# Altium schematic sheet mboard_usb.SchDoc: =GlobalProjectName
size 209 x 297 mm; SheetNumber: Лист; SheetTotal: Листов; PageSetup: Record=PageOptions|CenterHorizontal=True|CenterVertical=True|PrintScale=1.00|XCorrection=1.00|YCorrection=1.00|PrintKind=1|BorderSize=5000000|LeftOffset=0|BottomOffset=0|Orientation=2|PaperLength=1000|PaperWidth=1000|Scale=100|PaperSource=15|PrintQuality=1200|MediaType=1|DitherType=10|PaperKind=A3|PrintScaleMode=1; Weight: -; ScaleFactor: -
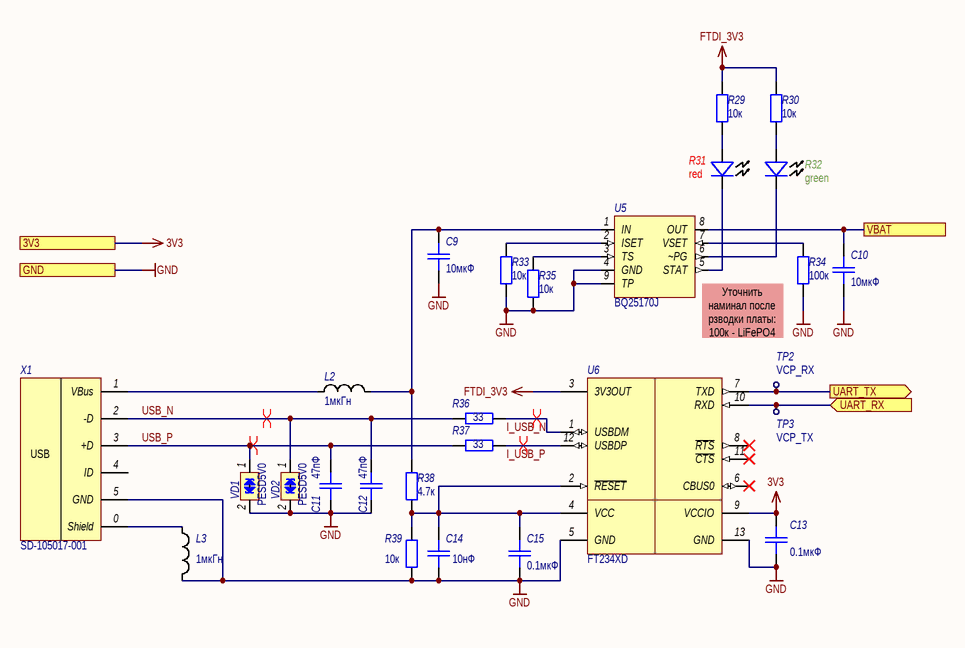
[diagram p0: mboard_usb.SchDoc]

## Parts
C9  10мкФ  [SMD_C0603]
C10  10мкФ  [SMD_C0603]
C11  47пФ  [SMD_C0402]
C12  47пФ  [SMD_C0402]
C13  0.1мкФ  [SMD_C0402]
C14  10нФ  [SMD_C0402]
C15  0.1мкФ  [SMD_C0402]
L2  1мкГн  [SMD_0805]
L3  1мкГн  [SMD_0805]
R29  10к  [SMD_0603]
R30  10к  [SMD_0603]
R31  value red  [LED_0402_RED]  (hidden comment: LED)
R32  value green  [LED_0402_RED]  (hidden comment: LED)
R33  10к  [SMD_0603]
R34  100к  [SMD_0603]
R35  10к  [SMD_0603]
R36  33  [SMD_0603]
R37  33  [SMD_0603]
R38  4.7к  [SMD_0603]
R39  10к  [SMD_0603]
TP2  VCP_RX  [TestPoint]
TP3  VCP_TX  [TestPoint]
U5  BQ25170J
U6  FT234XD  [DFN-12]
VD1  PESD5V0  [SOD-323]
VD2  PESD5V0  [SOD-323]
X1  Наименование: SD-105017-001  [MicroUSB-Molex-105017]  (hidden comment: mico-BF)

## Ports
3V3, GND, UART_RX (in), UART_TX (out), VBAT

## Nets
3V3: C13.2 U6.9(VCCIO) ; port 3V3
FTDI_3V3: R29.1 R30.1 U6.3(3V3OUT)
GND: C9.1 C10.1 C11.1 C12.1 C13.1 C14.1 C15.1 L3.2 R33.2 R34.2 R35.2 R39.1 U5.4(GND) U5.9(TP) U6.5(GND) U6.13(GND) VD1.2(cathode_2) VD2.2(cathode_2) X1.5(GND) ; port GND
I_USB_N: R36.1 U6.1(USBDM)
I_USB_P: R37.1 U6.12(USBDP)
UART_RX: TP3.0(TP) U6.10(RXD) ; port UART_RX
UART_TX: TP2.0(TP) U6.7(TXD) ; port UART_TX
USB_N: C12.2 R36.2 VD2.1(cathode_1) X1.2(-D)
USB_P: C11.2 R37.2 VD1.1(cathode_1) X1.3(+D)
VBAT: C10.2 U5.8(OUT) ; port VBAT
NetC9_2: C9.2 L2.2 R38.1 U5.1(IN)
NetC14_2: C14.2 C15.2 R38.2 R39.2 U6.2(~{RESET}) U6.4(VCC)
NetL2_1: L2.1 X1.1(VBus)
NetL3_1: L3.1 X1.0(Shield)
NetR29_2: R29.2 R31.1(A)
NetR30_2: R30.2 R32.1(A)
NetR31_2: R31.2(K) U5.5(STAT)
NetR32_2: R32.2(K) U5.6(~PG)
NetR33_1: R33.1 U5.2(ISET)
NetR34_1: R34.1 U5.7(VSET)
NetR35_1: R35.1 U5.3(TS)

Not connected (* = marked no-connect by the designer): U6 6(CBUS0)* 8(~{RTS})* 11(~{CTS})*; X1 4(ID)

## Layout directives
differential pair: I_USB_N, I_USB_P, USB_N, USB_P

## Notes on the sheet
- (near U5) Уточнить наминал после рзводки платы:
  100к - LiFePO4 3V5
- Подп. и дата
- Инв. № дубл.
- Взам. инв. №
- Инв. № подл.
- Изм.
- Лист
- № докум.
- Подп.
- Дата
- Форма 2а ГОСТ 2.104-2006
- Копировал
- Формат А4
- (in symbol MicroUSB) USB

## Library data of the parts
C9-C15 = Capacitor: Назначение: SMD-конденсатор; Наименование: Конденсатор; Потребление, Вт: 0
  C9 C10: Value: 10мкФ
  C11 C12: Value: 47пФ
  C13 C15: Value: 0.1мкФ
  C14: Value: 10нФ
L2 L3 = Inductor: Наименование: Индуктивность; Назначение: SMD-индуктивность; Потребление, Вт: 0,010; Value: 1мкГн
R29 R30 R33-R39 = Resistor: PE1206DRM470R01L; Наименование: Резистор; Назначение: SMD-резистор; Потребление, Вт: 0,001
  R29 R30 R33 R35 R39: Value: 10к
  R34: Value: 100к
  R36 R37: Value: 33
  R38: Value: 4.7к
R31 R32 = LED: Назначение: LED 0402 red; Наименование: SMD-LED; Потребление, Вт: 0,01
TP2 TP3 = TP: Наименование: Точка проверки; Назначение: Контроль параметров платы
  TP2: TP_Name: VCP_RX
  TP3: TP_Name: VCP_TX
U5 = BQ25170J: 800-mA JEITA-Compliant Linear Battery Charger for 1-Cell Li-Ion, LiPolymer, and LiFePO4; Потребление, Вт: 0,001; ComponentLink1Description: DataSheet; ComponentLink1URL: https://www.ti.com/lit/ds/symlink/bq25170j.pdf?ts=1636221072761&ref_url=https%253A%252F%252Fwww.ti.com%252Fproduct%252FBQ25170J; Назначение: 800-mA JEITA-Compliant Linear Battery Charger for 1-Cell Li-Ion, LiPolymer, and LiFePO4; Наименование: BQ25170J
U6 = FT234XD: USB TO BASIC UART IC; Потребление, Вт: 0.03; Назначение: USB TO BASIC UART IC; ComponentLink1Description: DataSheet; ComponentLink1URL: https://ftdichip.com/wp-content/uploads/2020/08/DS_FT234XD.pdf; Supplier 1: Newark; Supplier Part Number 1: 53X3171; Наименование: FT234XD
VD1 VD2 = PESDxL1BA: Low capacitance bidirectional ESD protection diodes; Назначение: ESD защитные диоды; Потребление, Вт: 0.0; Наименование: PESDxL1BA; ComponentLink1Description: DataSheet; ComponentLink1URL: https://static.chipdip.ru/lib/635/DOC005635911.pdf
X1 = MicroUSB: MicroUSB bottom mount receptacle, B-type; Потребление, Вт: 0; Назначение: MicroUSB bottom mount receptacle, B-type; DataSheet: *